# Altium schematic sheet SinWaveCreator.SchDoc
size A4
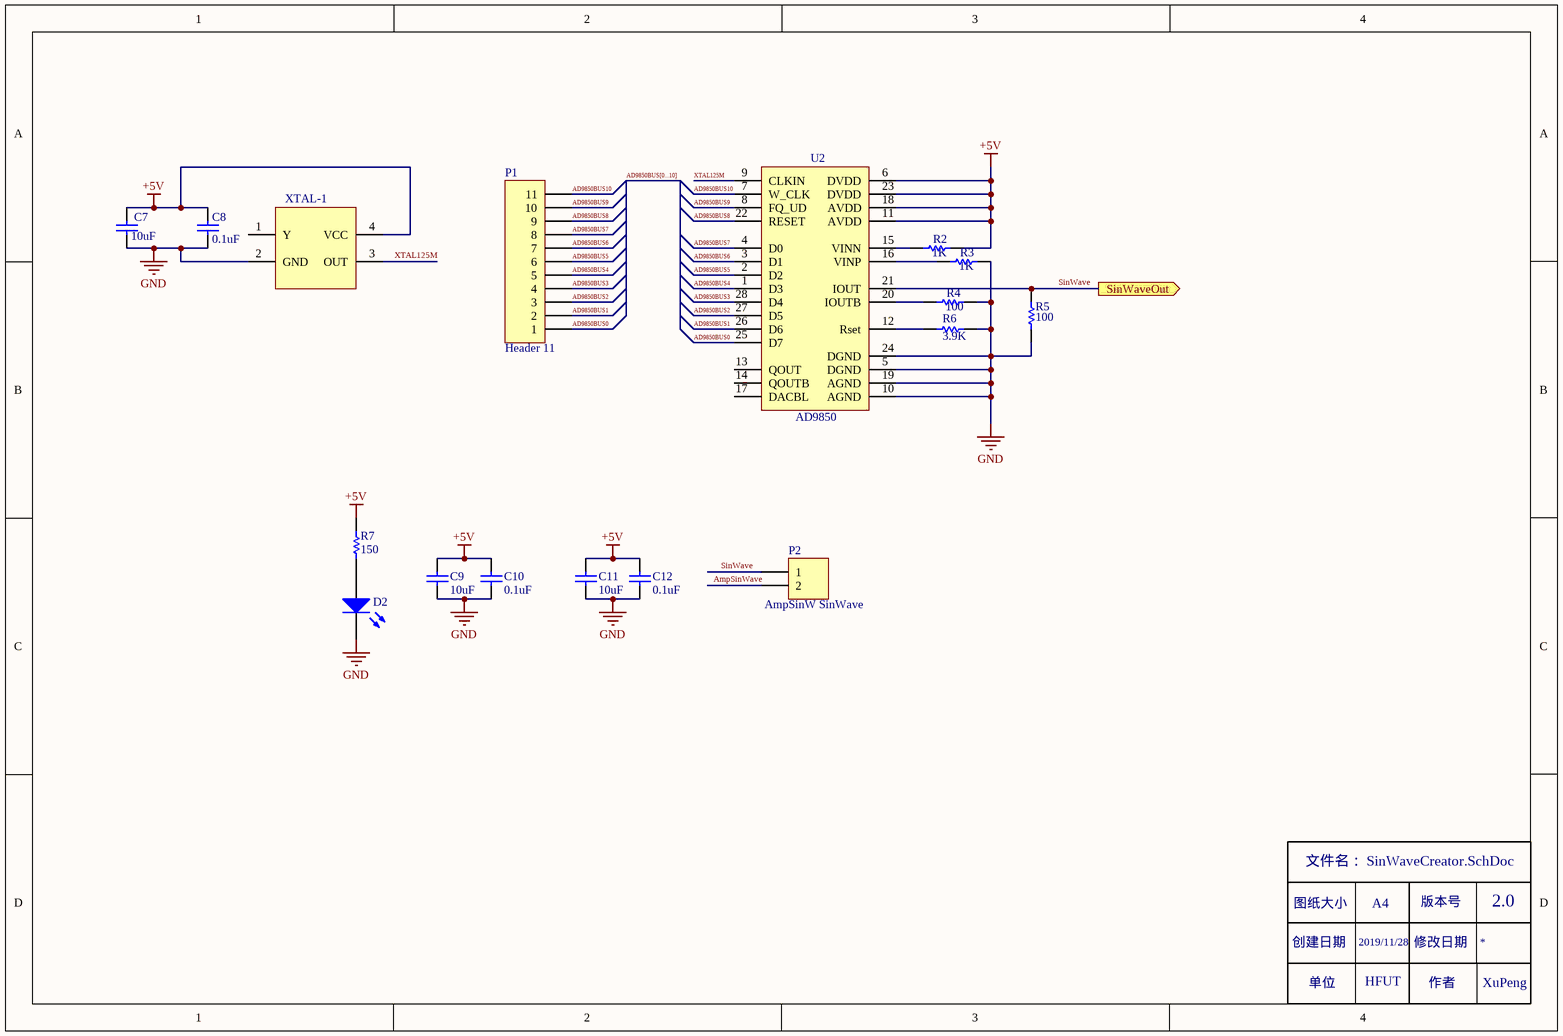
[diagram p0: SinWaveCreator.SchDoc]

## Parts
C7  value 10uF  [RB0.1/0.2]  (hidden comment: Cap)
C8  value 0.1uF  [C-RAD]  (hidden comment: Cap)
C9  value 10uF  [RB0.1/0.2]  (hidden comment: Cap)
C10  value 0.1uF  [C-RAD]  (hidden comment: Cap)
C11  value 10uF  [RB0.1/0.2]  (hidden comment: Cap)
C12  value 0.1uF  [C-RAD]  (hidden comment: Cap)
D2  LED0  [RB2.54/4]  (value not drawn)
P1  Header 11  [HDR1X11]
P2  AmpSinW SinWave  [HDR1X2]
R2  value 1K  [AXIAL-0.3]  (hidden comment: Res1)
R3  value 1K  [AXIAL-0.3]  (hidden comment: Res1)
R4  value 100  [AXIAL-0.3]  (hidden comment: Res1)
R5  value 100  [AXIAL-0.3]  (hidden comment: Res1)
R6  value 3.9K  [AXIAL-0.3]  (hidden comment: Res1)
R7  value 150  [AXIAL-0.3]  (hidden comment: Res1)
U2  AD9850  [SSOP28]
XTAL-1  XTAL-125M-7.62  [XTAL-4-7.62]  (value not drawn)

## Ports
SinWaveOut (out)

## Nets
+5V: C7.2 C8.2 C9.2 C10.2 C11.2 C12.2 R2.2 R7.2 U2.6(DVDD) U2.11(AVDD) U2.18(AVDD) U2.23(DVDD) XTAL-1.4(VCC)
GND: C7.1 C8.1 C9.1 C10.1 C11.1 C12.1 D2.2(K) R3.2 R4.2 R5.1 R6.2 U2.5(DGND) U2.10(AGND) U2.19(AGND) U2.24(DGND) XTAL-1.2(GND)
AD9850BUS0: P1.1 U2.25(D7)
AD9850BUS1: P1.2 U2.26(D6)
AD9850BUS2: P1.3 U2.27(D5)
AD9850BUS3: P1.4 U2.28(D4)
AD9850BUS4: P1.5 U2.1(D3)
AD9850BUS5: P1.6 U2.2(D2)
AD9850BUS6: P1.7 U2.3(D1)
AD9850BUS7: P1.8 U2.4(D0)
AD9850BUS8: P1.9 U2.22(RESET)
AD9850BUS9: P1.10 U2.8(FQ_UD)
AD9850BUS10: P1.11 U2.7(W_CLK)
AmpSinWave: P2.2
SinWave: P2.1 R5.2 U2.21(IOUT) ; port SinWaveOut
XTAL125M: U2.9(CLKIN) XTAL-1.3(OUT)
NetD2_1: D2.1(A) R7.1
NetR2_1: R2.1 U2.15(VINN)
NetR3_1: R3.1 U2.16(VINP)
NetR4_1: R4.1 U2.20(IOUTB)
NetR6_1: R6.1 U2.12(Rset)

Not connected (* = marked no-connect by the designer): U2 13(QOUT) 14(QOUTB) 17(DACBL); XTAL-1 1(Y)

## Buses and harness runs
bus AD9850BUS[0...10]

## Notes on the sheet
- 2.0
- 图纸大小
- 文件名：
- A4
- 版本号
- 创建日期
- 单位
- 2019/11/28
- HFUT
- 修改日期
- 作者
- XuPeng

## Library data of the parts
C7-C12 = Cap: 无极性电容; Published: 8-Jun-2000; PackageReference: RAD-0.3; Publisher: Altium Limited; LatestRevisionDate: 17-Jul-2002; LatestRevisionNote: Re-released for DXP Platform.
D2 = LED0: Typical INFRARED GaAs LED; Published: 8-Jun-2000; LatestRevisionDate: 08-Jul-2005; LatestRevisionNote: Mech Layer 1 removed.; PackageReference: LED-0; Publisher: Altium Limited; PackageDescription: LED; 2 Leads
P1 = Header 11: Header, 11-Pin; LatestRevisionDate: 17-Jul-2002; LatestRevisionNote: Re-released for DXP Platform.; Publisher: Altium Limited
P2 = Header 2: Header, 2-Pin; LatestRevisionDate: 17-Jul-2002; LatestRevisionNote: Re-released for DXP Platform.; Publisher: Altium Limited
R2-R7 = Res1: Resistor; Published: 8-Jun-2000; LatestRevisionDate: 17-Jul-2002; LatestRevisionNote: Re-released for DXP Platform.; PackageReference: AXIAL-0.3; Publisher: Altium Limited; PackageDescription: Axial Device, Thru-Hole; 2 Leads; 0.3 in Pin Spacing